# Altium schematic sheet SCH_KPHONE.SchDoc: Điện thoại đi động Arduino Phone
size A2; Author: Thành Trung; SheetNumber: 1; SheetTotal: 1
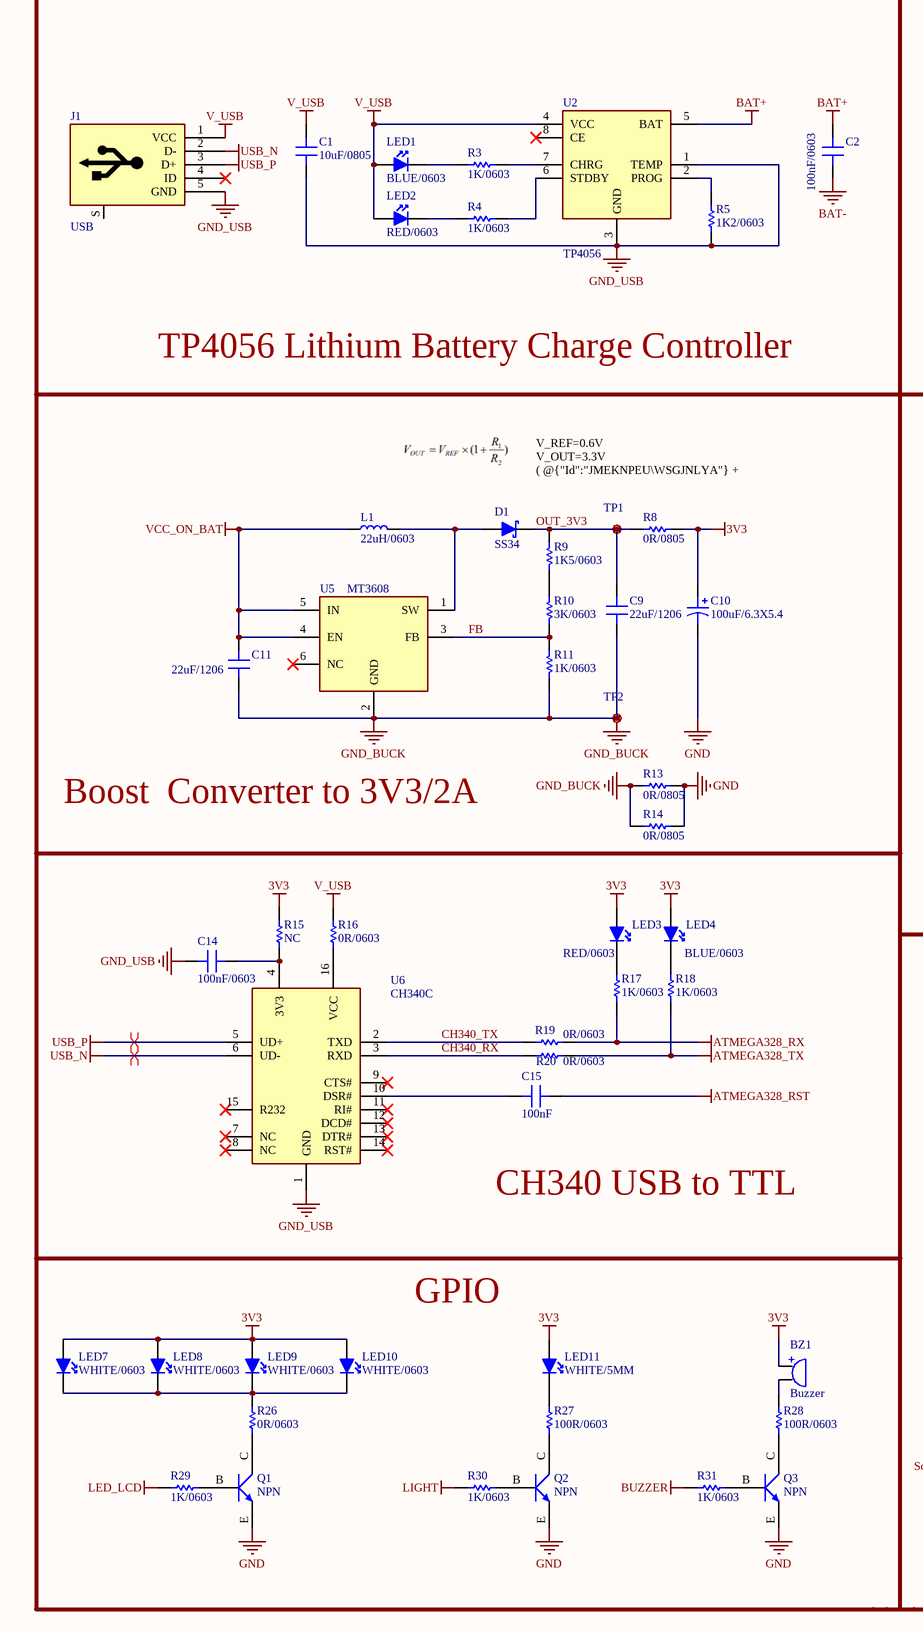
[diagram p0: SCH_KPHONE.SchDoc, left]
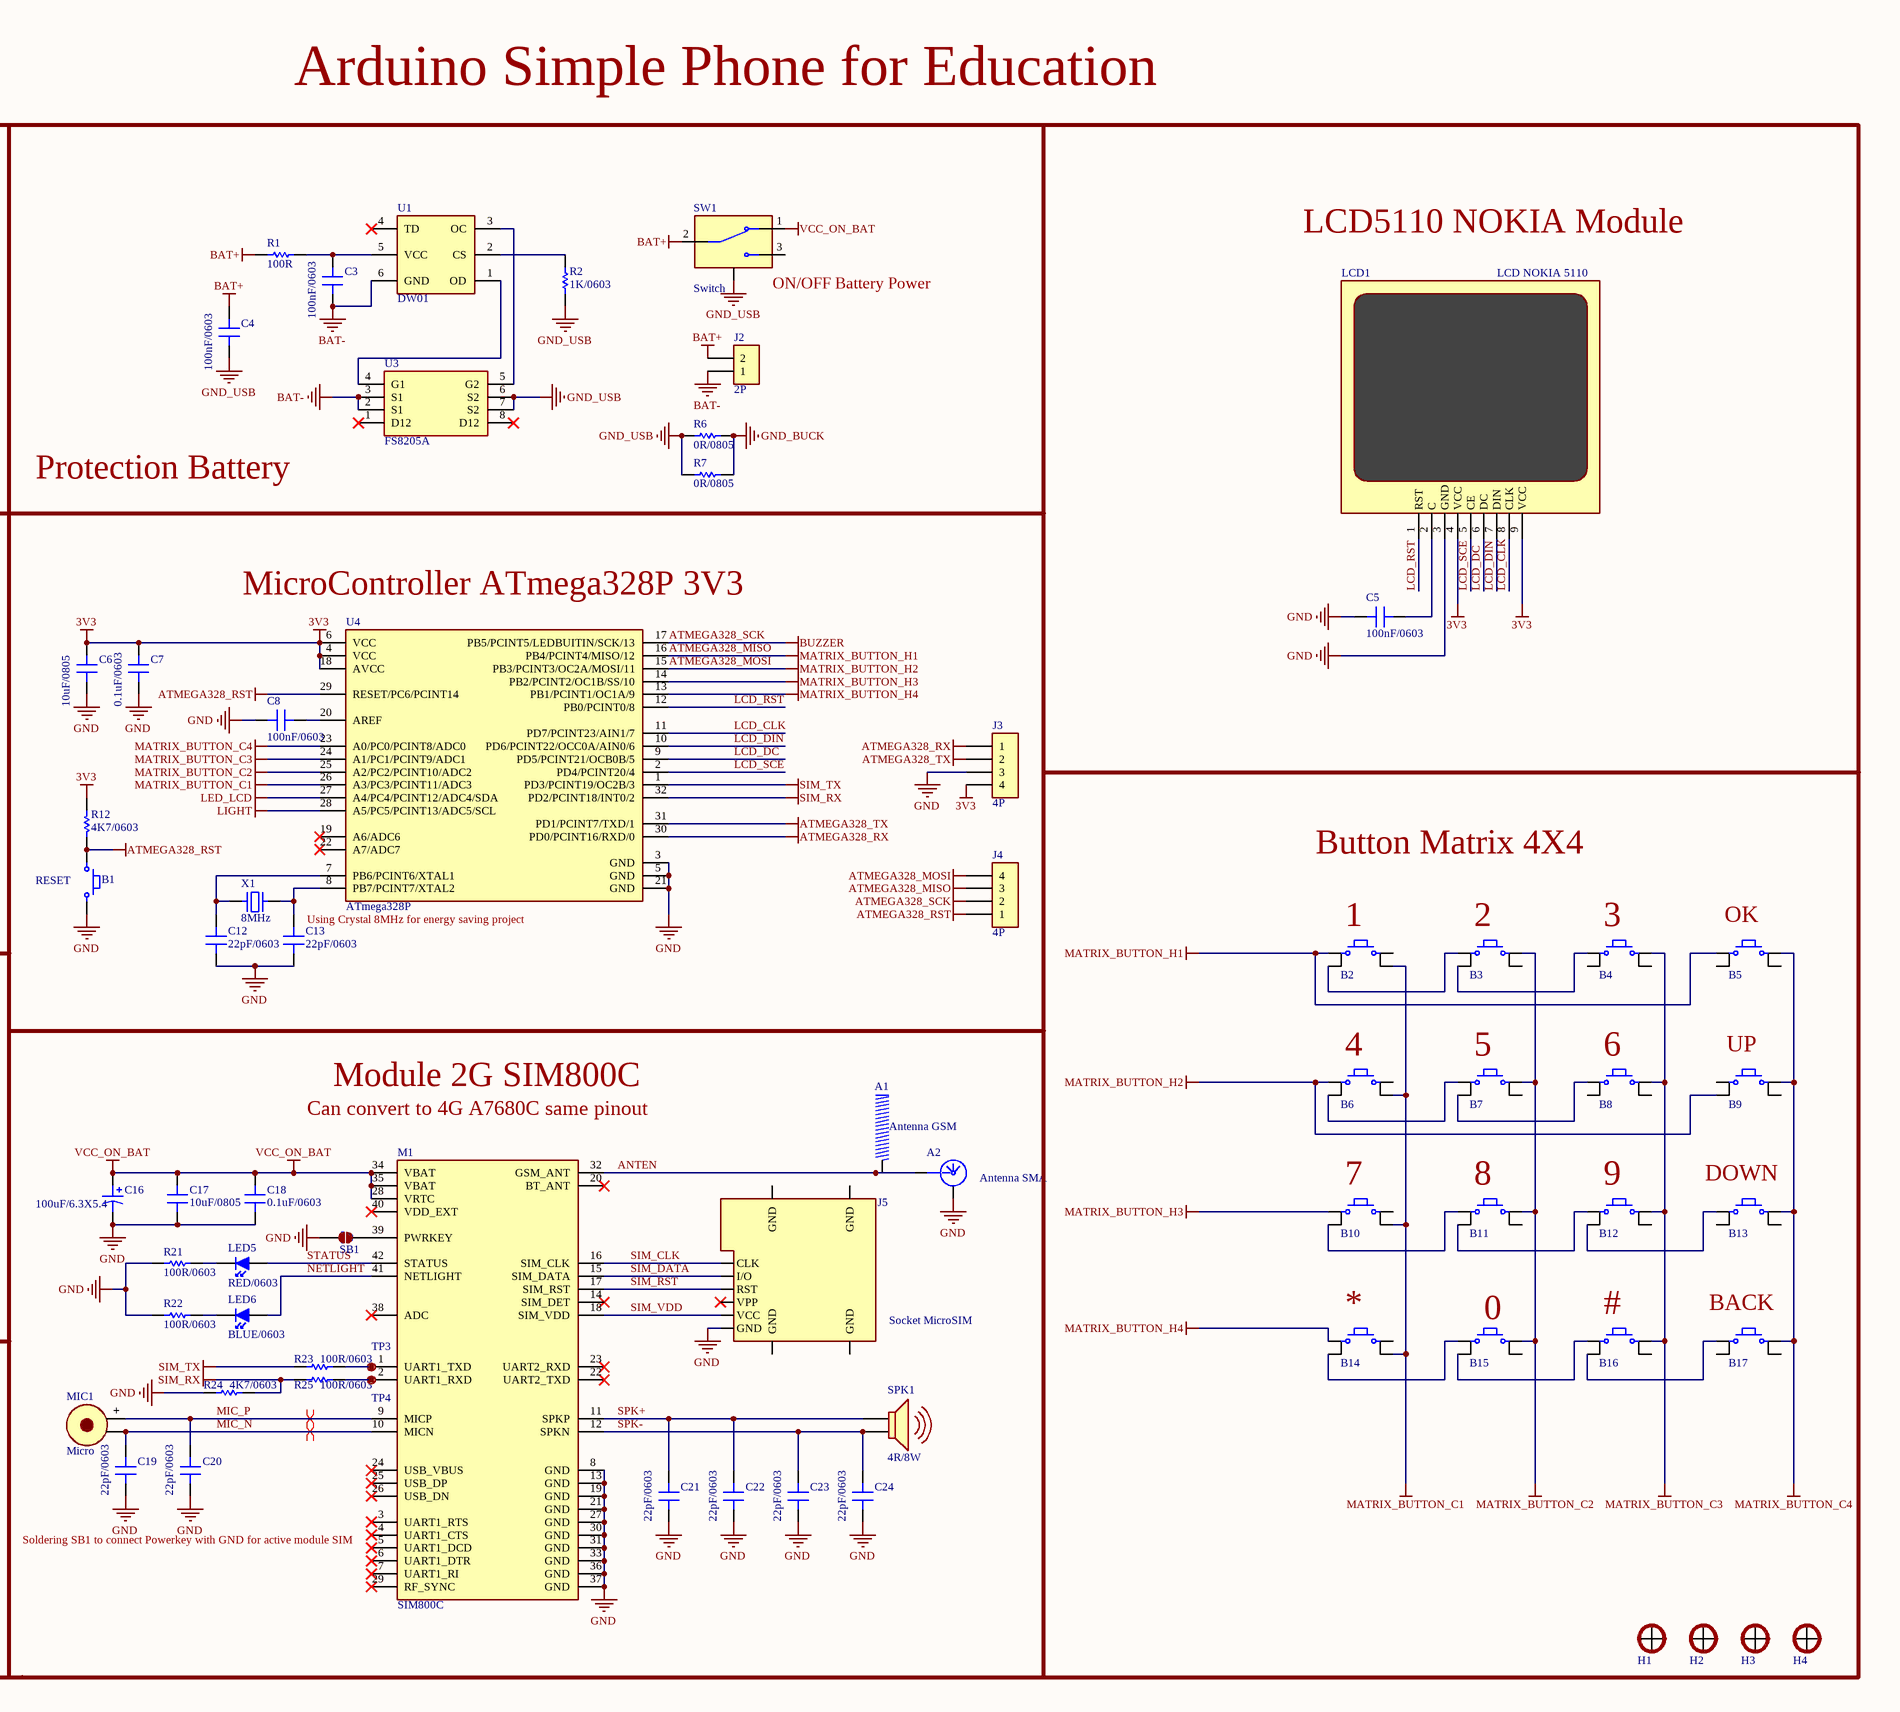
[diagram p1: SCH_KPHONE.SchDoc, right]

## Parts
A1  Antenna GSM  [ANTEN GSM]  (no BOM)
A2  Antenna SMA  [ANTEN SMA FEMALE]
B1  RESET  [BUTTON-SMD-2P-3x6x2.5MM]
B2  Button  [BUTTON-SMD-4P-6X6X5MM]  (value not drawn)
B3  Button  [BUTTON-SMD-4P-6X6X5MM]  (value not drawn)
B4  Button  [BUTTON-SMD-4P-6X6X5MM]  (value not drawn)
B5  Button  [BUTTON-SMD-4P-6X6X5MM]  (value not drawn)
B6  Button  [BUTTON-SMD-4P-6X6X5MM]  (value not drawn)
B7  Button  [BUTTON-SMD-4P-6X6X5MM]  (value not drawn)
B8  Button  [BUTTON-SMD-4P-6X6X5MM]  (value not drawn)
B9  Button  [BUTTON-SMD-4P-6X6X5MM]  (value not drawn)
B10  Button  [BUTTON-SMD-4P-6X6X5MM]  (value not drawn)
B11  Button  [BUTTON-SMD-4P-6X6X5MM]  (value not drawn)
B12  Button  [BUTTON-SMD-4P-6X6X5MM]  (value not drawn)
B13  Button  [BUTTON-SMD-4P-6X6X5MM]  (value not drawn)
B14  Button  [BUTTON-SMD-4P-6X6X5MM]  (value not drawn)
B15  Button  [BUTTON-SMD-4P-6X6X5MM]  (value not drawn)
B16  Button  [BUTTON-SMD-4P-6X6X5MM]  (value not drawn)
B17  Button  [BUTTON-SMD-4P-6X6X5MM]  (value not drawn)
BZ1  Buzzer  [BUZZER_9055]
C1  10uF/0805  [CAP-0805]
C2  100nF/0603  [CAP-0603]
C3  100nF/0603  [CAP-0603]
C4  100nF/0603  [CAP-0603]
C5  100nF/0603  [CAP-0603]
C6  10uF/0805  [CAP-0805]
C7  0.1uF/0603  [CAP-0603]
C8  100nF/0603  [CAP-0603]
C9  22uF/1206  [CAP-1206]
C10  100uF/6.3X5.4  [CAPP-SMD-ALU-6.3X5.4MM-D]
C11  22uF/1206  [CAP-1206]
C12  22pF/0603  [CAP-0603]
C13  22pF/0603  [CAP-0603]
C14  100nF/0603  [CAP-0603]
C15  100nF  [CAP-0603]
C16  100uF/6.3X5.4  [CAPP-SMD-ALU-6.3X5.4MM-D]
C17  10uF/0805  [CAP-0805]
C18  0.1uF/0603  [CAP-0603]
C19  22pF/0603  [CAP-0603]
C20  22pF/0603  [CAP-0603]
C21  22pF/0603  [CAP-0603]
C22  22pF/0603  [CAP-0603]
C23  22pF/0603  [CAP-0603]
C24  22pF/0603  [CAP-0603]
D1  SS34  [DIODE-SMD-DO-214AC]
H1  (no value)  [HOLE-M3]  (no BOM)
H2  (no value)  [HOLE-M3]  (no BOM)
H3  (no value)  [HOLE-M3]  (no BOM)
H4  (no value)  [HOLE-M3]  (no BOM)
J1  USB  [USB-FEMALE-MICRO-DIP]
J2  2P  [XH2.54-2P-R]
J3  4P  [JUMP-2.54-MALE-4P-NB]  (no BOM)
J4  4P  [JUMP-2.54-MALE-4P-NB]  (no BOM)
J5  Socket MicroSIM  [SOCKET-MICRO-SIM-6P]
L1  22uH/0603  [INDUCTOR-SMD-0630]
LCD1  LCD NOKIA 5110  [LCD NOKIA 5110-SMD]
LED1  BLUE/0603  [LED-0603-BLUE]
LED2  RED/0603  [LED-0603-RED]
LED3  RED/0603  [LED-0603-RED]
LED4  BLUE/0603  [LED-0603-BLUE]
LED5  RED/0603  [LED-0603-RED]
LED6  BLUE/0603  [LED-0603-BLUE]
LED7  WHITE/0603  [LED-0603-WHITE]
LED8  WHITE/0603  [LED-0603-WHITE]
LED9  WHITE/0603  [LED-0603-WHITE]
LED10  WHITE/0603  [LED-0603-WHITE]
LED11  WHITE/5MM  [LED-5MM-RED-R]
M1  SIM800C  [SIM800C]
MIC1  Micro  [MICRO-DIP-4.5X2.2-P2.0]
Q1  NPN  [TRANSISTOR-SOT-23-BCE]
Q2  NPN  [TRANSISTOR-SOT-23-BCE]
Q3  NPN  [TRANSISTOR-SOT-23-BCE]
R1  100R  [RES-0603]
R2  1K/0603  [RES-0603]
R3  1K/0603  [RES-0603]
R4  1K/0603  [RES-0603]
R5  1K2/0603  [RES-0603]
R6  0R/0805  [RES-0805]
R7  0R/0805  [RES-0805]
R8  0R/0805  [RES-0805]
R9  1K5/0603  [RES-0603]
R10  3K/0603  [RES-0603]
R11  1K/0603  [RES-0603]
R12  4K7/0603  [RES-0603]
R13  0R/0805  [RES-0805]
R14  0R/0805  [RES-0805]
R15  NC  [RES-0603]
R16  0R/0603  [RES-0603]
R17  1K/0603  [RES-0603]
R18  1K/0603  [RES-0603]
R19  0R/0603  [RES-0603]
R20  0R/0603  [RES-0603]
R21  100R/0603  [RES-0603]
R22  100R/0603  [RES-0603]
R23  100R/0603  [RES-0603]
R24  4K7/0603  [RES-0603]
R25  100R/0603  [RES-0603]
R26  0R/0603  [RES-0603]
R27  100R/0603  [RES-0603]
R28  100R/0603  [RES-0603]
R29  1K/0603  [RES-0603]
R30  1K/0603  [RES-0603]
R31  1K/0603  [RES-0603]
SB1  (no value)  [SOLDER-BRIDGE-2]  (no BOM)
SPK1  4R/8W  [SPEAKER 9X22MM]
SW1  Switch  [SWITCH-3PIN-R]
TP1  TESTPOINT  [TESTPOINT]  (value not drawn)  (no BOM)
TP2  TESTPOINT  [TESTPOINT]  (value not drawn)  (no BOM)
TP3  TESTPOINT  [TESTPOINT]  (value not drawn)  (no BOM)
TP4  TESTPOINT  [TESTPOINT]  (value not drawn)  (no BOM)
U1  DW01  [SOT-23-6]
U2  TP4056  [TP4056]
U3  FS8205A  [FS8205A]
U4  ATmega328P  [TQFP-32]
U5  MT3608  [SOT-23-6]
U6  CH340C  [SOP-16]
X1  8MHz  [CRYSTAL-SMD-5032-2P]

## Nets
3V3: BZ1.1 C6.2 C7.2 C10.1(+) J3.4 LCD1.4(VCC) LCD1.9(VCC) LED3.1(A) LED4.1(A) LED7.1(A) LED8.1(A) LED9.1(A) LED10.1(A) LED11.1(A) R8.2 R12.1 R15.2 U4.4(VCC) U4.6(VCC) U4.18(AVCC)
ATMEGA328_MISO: B2.1 B5.1 J4.3 U4.16(PB4/PCINT4/MISO/12)  [also labelled MATRIX_BUTTON_H1]
ATMEGA328_MOSI: B6.1 B9.3 J4.4 U4.15(PB3/PCINT3/OC2A/MOSI/11)  [also labelled MATRIX_BUTTON_H2]
ATMEGA328_RST: B1.2 C15.2 J4.1 R12.2 U4.29(RESET/PC6/PCINT14)
ATMEGA328_RX: J3.1 R17.2 R19.2 U4.30(PD0/PCINT16/RXD/0)
ATMEGA328_SCK: J4.2 R31.1 U4.17(PB5/PCINT5/LEDBUITIN/SCK/13)  [also labelled BUZZER]
ATMEGA328_TX: J3.2 R18.2 R20.2 U4.31(PD1/PCINT7/TXD/1)
BAT+: C2.1 C4.1 J2.2 R1.1 SW1.2(COM1) U2.5(BAT)
BAT-: C2.2 C3.2 J2.1 U1.6(GND) U3.2(S1) U3.3(S1)
GND: A2.2(GND) B1.1 C5.2 C6.1 C7.1 C8.1 C10.2(-) C12.2 C13.2 C16.2(-) C17.1 C18.1 C19.2 C20.1 C21.1 C22.2 C23.2 C24.2 J3.3 J5.C5(GND) LCD1.3(GND) M1.8(GND) M1.13(GND) M1.19(GND) M1.21(GND) M1.27(GND) M1.30(GND) M1.31(GND) M1.33(GND) M1.36(GND) M1.37(GND) Q1.E Q2.E Q3.E R13.1 R14.1 R21.2 R22.2 R24.2 SB1.1 U4.3(GND) U4.5(GND) U4.21(GND)
GND_BUCK: C9.1 C11.1 R6.2 R7.2 R11.2 R13.2 R14.2 TP2.1 U5.2(GND)
GND_USB: C1.1 C4.2 C14.1 J1.5(GND) R2.2 R5.1 R6.1 R7.1 SW1.0(NO1) U2.1(TEMP) U2.3(GND) U3.6(S2) U3.7(S2) U6.1(GND)
LED_LCD: R29.1 U4.27(A4/PC4/PCINT12/ADC4/SDA)
LIGHT: R30.1 U4.28(A5/PC5/PCINT13/ADC5/SCL)
MATRIX_BUTTON_C1: B2.4 B6.4 B10.4 B14.4 U4.26(A3/PC3/PCINT11/ADC3)
MATRIX_BUTTON_C2: B3.2 B7.2 B11.2 B15.2 U4.25(A2/PC2/PCINT10/ADC2)
MATRIX_BUTTON_C3: B4.2 B8.2 B12.2 B16.2 U4.24(A1/PC1/PCINT9/ADC1)
MATRIX_BUTTON_C4: B5.2 B9.2 B13.2 B17.2 U4.23(A0/PC0/PCINT8/ADC0)
MATRIX_BUTTON_H3: B10.1 U4.14(PB2/PCINT2/OC1B/SS/10)
MATRIX_BUTTON_H4: B14.1 U4.13(PB1/PCINT1/OC1A/9)
SIM_RX: R24.1 R25.1 U4.32(PD2/PCINT18/INT0/2)
SIM_TX: R23.2 U4.1(PD3/PCINT19/OC2B/3)
USB_N: J1.2(D-) U6.6(UD-)
USB_P: J1.3(D+) U6.5(UD+)
V_USB: C1.2 J1.1(VCC) LED1.1(A) LED2.1(A) R16.2 U2.4(VCC)
VCC_ON_BAT: C11.2 C16.1(+) C17.2 C18.2 L1.1 M1.28(VRTC) M1.34(VBAT) M1.35(VBAT) SW1.1(NC1) U5.4(EN) U5.5(IN)
ANTEN: A1.1(RF) A2.1 M1.32(GSM_ANT)
CH340_RX: R20.1 U6.3(RXD)
CH340_TX: R19.1 U6.2(TXD)
FB: R10.2 R11.1 U5.3(FB)
LCD_CLK: LCD1.8(CLK) U4.11(PD7/PCINT23/AIN1/7)
LCD_DC: LCD1.6(DC) U4.9(PD5/PCINT21/OCB0B/5)
LCD_DIN: LCD1.7(DIN) U4.10(PD6/PCINT22/OCC0A/AIN0/6)
LCD_RST: LCD1.1(RST) U4.12(PB0/PCINT0/8)
LCD_SCE: LCD1.5(CE) U4.2(PD4/PCINT20/4)
MIC_N: C19.1 M1.10(MICN) MIC1.2(MIC-)
MIC_P: C20.2 M1.9(MICP) MIC1.1(+)
NETLIGHT: LED6.1(A) M1.41(NETLIGHT)
OUT_3V3: C9.2 D1.C(K) R8.1 R9.1 TP1.1
SIM_CLK: J5.C3(CLK) M1.16(SIM_CLK)
SIM_DATA: J5.C7(I/O) M1.15(SIM_DATA)
SIM_RST: J5.C2(RST) M1.17(SIM_RST)
SIM_VDD: J5.C1(VCC) M1.18(SIM_VDD)
SPK+: C21.2 C22.1 M1.11(SPKP) SPK1.2(SPK-)
SPK-: C23.1 C24.1 M1.12(SPKN) SPK1.1(SPK+)
STATUS: LED5.1(A) M1.42(STATUS)
NetB2_3: B2.3 B3.1
NetB3_3: B3.3 B4.1
NetB6_3: B6.3 B7.1
NetB7_3: B7.3 B8.1
NetB10_3: B10.3 B11.1
NetB11_3: B11.3 B12.1
NetB12_3: B12.3 B13.1
NetB14_3: B14.3 B15.1
NetB15_3: B15.3 B16.1
NetB16_3: B16.3 B17.1
NetBZ1_2: BZ1.2 R28.1
NetC3_1: C3.1 R1.2 U1.5(VCC)
NetC5_1: C5.1 LCD1.2(C)
NetC8_2: C8.2 U4.20(AREF)
NetC12_1: C12.1 U4.7(PB6/PCINT6/XTAL1) X1.1
NetC13_1: C13.1 U4.8(PB7/PCINT7/XTAL2) X1.2
NetC14_2: C14.2 R15.1 U6.4(3V3)
NetC15_1: C15.1 U6.10(DSR#)
NetD1_A: D1.A L1.2 U5.1(SW)
NetLED1_2: LED1.2(K) R3.1
NetLED2_2: LED2.2(K) R4.1
NetLED3_2: LED3.2(K) R17.1
NetLED4_2: LED4.2(K) R18.1
NetLED5_2: LED5.2(K) R21.1
NetLED6_2: LED6.2(K) R22.1
NetLED7_2: LED7.2(K) LED8.2(K) LED9.2(K) LED10.2(K) R26.1
NetLED11_2: LED11.2(K) R27.1
NetM1_1: M1.1(UART1_TXD) R23.1 TP3.1
NetM1_2: M1.2(UART1_RXD) R25.2 TP4.1
NetM1_39: M1.39(PWRKEY) SB1.2
NetQ1_B: Q1.B R29.2
NetQ1_C: Q1.C R26.2
NetQ2_B: Q2.B R30.2
NetQ2_C: Q2.C R27.2
NetQ3_B: Q3.B R31.2
NetQ3_C: Q3.C R28.2
NetR2_1: R2.1 U1.2(CS)
NetR3_2: R3.2 U2.7(CHRG)
NetR4_2: R4.2 U2.6(STDBY)
NetR5_2: R5.2 U2.2(PROG)
NetR9_2: R9.2 R10.1
NetR16_1: R16.1 U6.16(VCC)
NetU1_1: U1.1(OD) U3.4(G1)
NetU1_3: U1.3(OC) U3.5(G2)

Not connected (* = marked no-connect by the designer): B2 2; B3 4; B4 3 4; B5 3 4; B6 2; B7 4; B8 3 4; B9 1 4; B10 2; B11 4; B12 4; B13 3 4; B14 2; B15 4; B16 4; B17 3 4; H1 1; H2 1; H3 1; H4 1; J1 4(ID)* S(GND); J5 C6(VPP)* S1(GND) S2(GND) S3(GND) S4(GND); M1 3(UART1_RTS)* 4(UART1_CTS)* 5(UART1_DCD)* 6(UART1_DTR)* 7(UART1_RI)* 14(SIM_DET)* 20(BT_ANT)* 22(UART2_TXD)* 23(UART2_RXD)* 24(USB_VBUS)* 25(USB_DP)* 26(USB_DN)* 29(RF_SYNC)* 38(ADC)* 40(VDD_EXT)*; SW1 3(NO1); U1 4(TD)*; U2 8(CE)*; U3 1(D12)* 8(D12)*; U4 19(A6/ADC6)* 22(A7/ADC7)*; U5 6(NC)*; U6 7(NC)* 8(NC)* 9(CTS#)* 11(RI#)* 12(DCD#)* 13(DTR#)* 14(RST#)* 15(R232)*

## Layout directives
differential pair: MIC_N, MIC_P, USB_N, USB_P

## Notes on the sheet
- Arduino Simple Phone for Education
- LCD5110 NOKIA Module
- (near SW1) ON/OFF Battery Power
- TP4056 Lithium Battery Charge Controller
- (near U3) Protection Battery
- V_REF=0.6V
  V_OUT=3.3V
  ( @{"Id":"JMEKNPEU\WSGJNLYA"} + @{"Id":"JMEKNPEU\GDNZRMBV"} ) / @{"Id":"JMEKNPEU\QJIDGHGJ"} = 45 / 10
- (near U4) MicroController ATmega328P 3V3
- Button Matrix 4X4
- Boost  Converter to 3V3/2A
- (near C13) Using Crystal 8MHz for energy saving project
- (near B2) 1
- (near B3) 2
- (near B4) 3
- (near B5) OK
- (near B6) 4
- (near B7) 5
- (near B8) 6
- (near B9) UP
- Can convert to 4G A7680C same pinout
- Module 2G SIM800C
- (near B10) 7
- (near B11) 8
- (near B12) 9
- (near B13) DOWN
- CH340 USB to TTL
- (near B14) *
- (near B16) #
- (near B17) BACK
- (near B15) 0
- GPIO
- (near M1) Soldering SB1 to connect Powerkey with GND for active module SIM
- (in symbol BUZZER) +

## Library data of the parts
A1 = ANTEN GSM
A2 = ANTENNA
B1 = BUTTON-2PIN: Nút nhấn 2 chân
B2-B17 = BUTTON-4PIN: Nút nhấn 4 chân
BZ1 = BUZZER: Còi chip
C1-C9 C11-C15 C17-C24 = CAP-SMD: Tụ dán
C10 C16 = CAPP-SMD: Tụ hoá dán
D1 = DIODE-SCHOTTKY: Diode Schottky
H1-H4 = HOLE-1P: Lỗ bắt vít
J1 = USB-5P: Cổng USB 5P; Part number: USB-B-Mini
J2 = HEADER-2PIN: Header 2P
J3 J4 = JUMP-4PIN: Jump 4P
J5 = SOCKET-SIM: Khe cắm Sim
L1 = INDUCTOR-SMD: Cuộn cảm dán
LCD1 = LCD NOKIA 5110 PCB: LCD Module màn hình Nokia 5110 SMD PCB
LED1-LED10 = LED-SMD: Led dán
LED11 = LED-DIP: Led cắm
M1 = SIM800C: Module SIM800C hàn mạch PCB
MIC1 = MICRO-DIP: Cảm biến âm thanh Microphone MIC
Q1-Q3 = TRANSISTOR-NPN: Transistor NPN
R1-R31 = RES-SMD: Điện trở dán
SB1 = SOLDER-BRIDGE-2: Cầu hàn 2
SPK1 = SPEAKER: Loa
SW1 = SWITCH-3PIN: Công tắc gạt
TP1-TP4 = TESTPOINT: Điểm Testpoint
U1 = DW01: IC DW01 Bảo vệ Pin SOT23-6
U2 = TP4056: IC TP4056 Quản lý sạc pin 3.7V SOP-8
U3 = FS8205A: IC FS8205A Dual N-Mosfet TSSOP-8
U4 = ATMEGA328P: IC ATmega328P IC MCU 8BIT 32KB FLASH 32P; MP: STM8S003F3P6; MF: STMicroelectronics; Availability: Unavailable; SnapEDA_Link: https://www.snapeda.com/parts/STM8S003F3P6/STMicroelectronics/view-part/47650/?ref=snap; Price: None; Value: *; Package: TSSOP-20 STMicroelectronics
U5 = MT3608: IC MT3608 DC-DC Converters 1.2MHz SOT-23-6; MF: Aerosemi Technology Co., Ltd; Package: Package Analog Devices; Availability: Unavailable; Value: *; MP: MT3608; SnapEDA_Link: https://www.snapeda.com/parts/MT3608/Aerosemi%20Technology%20Co.%2C%20Ltd/view-part/3218014/?ref=snap; Price: None
U6 = CH340C: IC CH340C Chuyển đổi USB to TTL 2Mbps USB2.0 SOP-16; MP: STM8S003F3P6; MF: STMicroelectronics; Availability: Unavailable; SnapEDA_Link: https://www.snapeda.com/parts/STM8S003F3P6/STMicroelectronics/view-part/47650/?ref=snap; Price: None; Value: *; Package: TSSOP-20 STMicroelectronics
X1 = CRYSTAL-2P: Thạch anh 2P